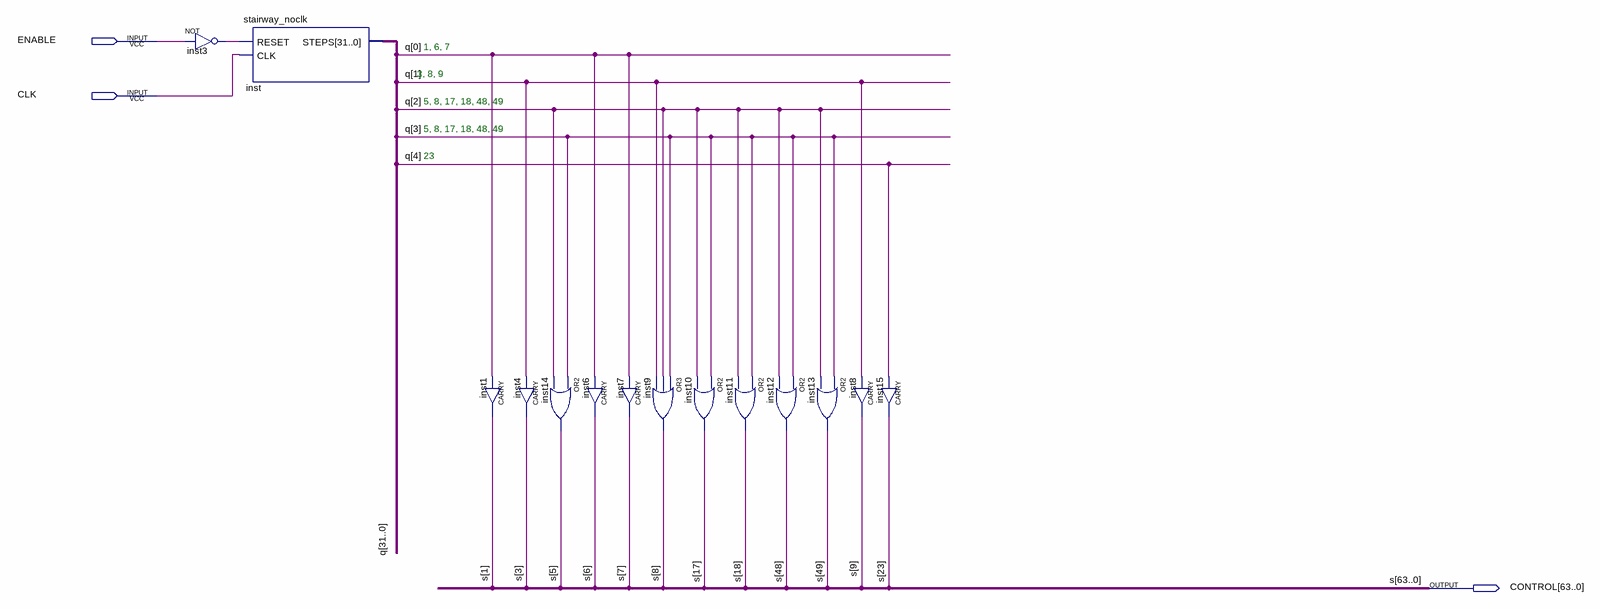
[diagram p0: schematic sheet]
// Quartus schematic macro_mov.bdf as structural Verilog: 14 symbols, 3 pins
module macro_mov (
  input  ENABLE,
  input  CLK,
  output [63:0] CONTROL
);

  wire inst3_out;
  wire [31:0] q;

  not inst3 (inst3_out, ENABLE);
  stairway_noclk inst (.RESET(inst3_out), .CLK(CLK), .STEPS(q));
  CARRY inst1 (.IN(q[0]), .OUT(CONTROL[1]));
  CARRY inst4 (.IN(q[1]), .OUT(CONTROL[3]));
  or inst14 (CONTROL[5], q[3], q[2]);
  CARRY inst6 (.IN(q[0]), .OUT(CONTROL[6]));
  CARRY inst7 (.IN(q[0]), .OUT(CONTROL[7]));
  or inst9 (CONTROL[8], q[3], q[2], q[1]);
  or inst10 (CONTROL[17], q[3], q[2]);
  or inst11 (CONTROL[18], q[3], q[2]);
  or inst12 (CONTROL[48], q[3], q[2]);
  or inst13 (CONTROL[49], q[3], q[2]);
  CARRY inst8 (.IN(q[1]), .OUT(CONTROL[9]));
  CARRY inst15 (.IN(q[4]), .OUT(CONTROL[23]));

  // Other names for the same wires on the sheet: s[63:0] = CONTROL

  // Notes on the sheet:
  //   1, 6, 7
  //   3, 8, 9
  //   5, 8, 17, 18, 48, 49
  //   5, 8, 17, 18, 48, 49
  //   23
endmodule
